# Altium schematic sheet TI_SN74LVCH16T245.SchDoc
size A4; CompanyName: Technische Hochschule Nürnberg Georg Simon Ohm; Address1: Fürther Straße 250; Address2: 90429 Nürnberg; Address3: GERMANY; SheetNumber: 17; SheetTotal: 17; CompanyName2: Institut ELSYS
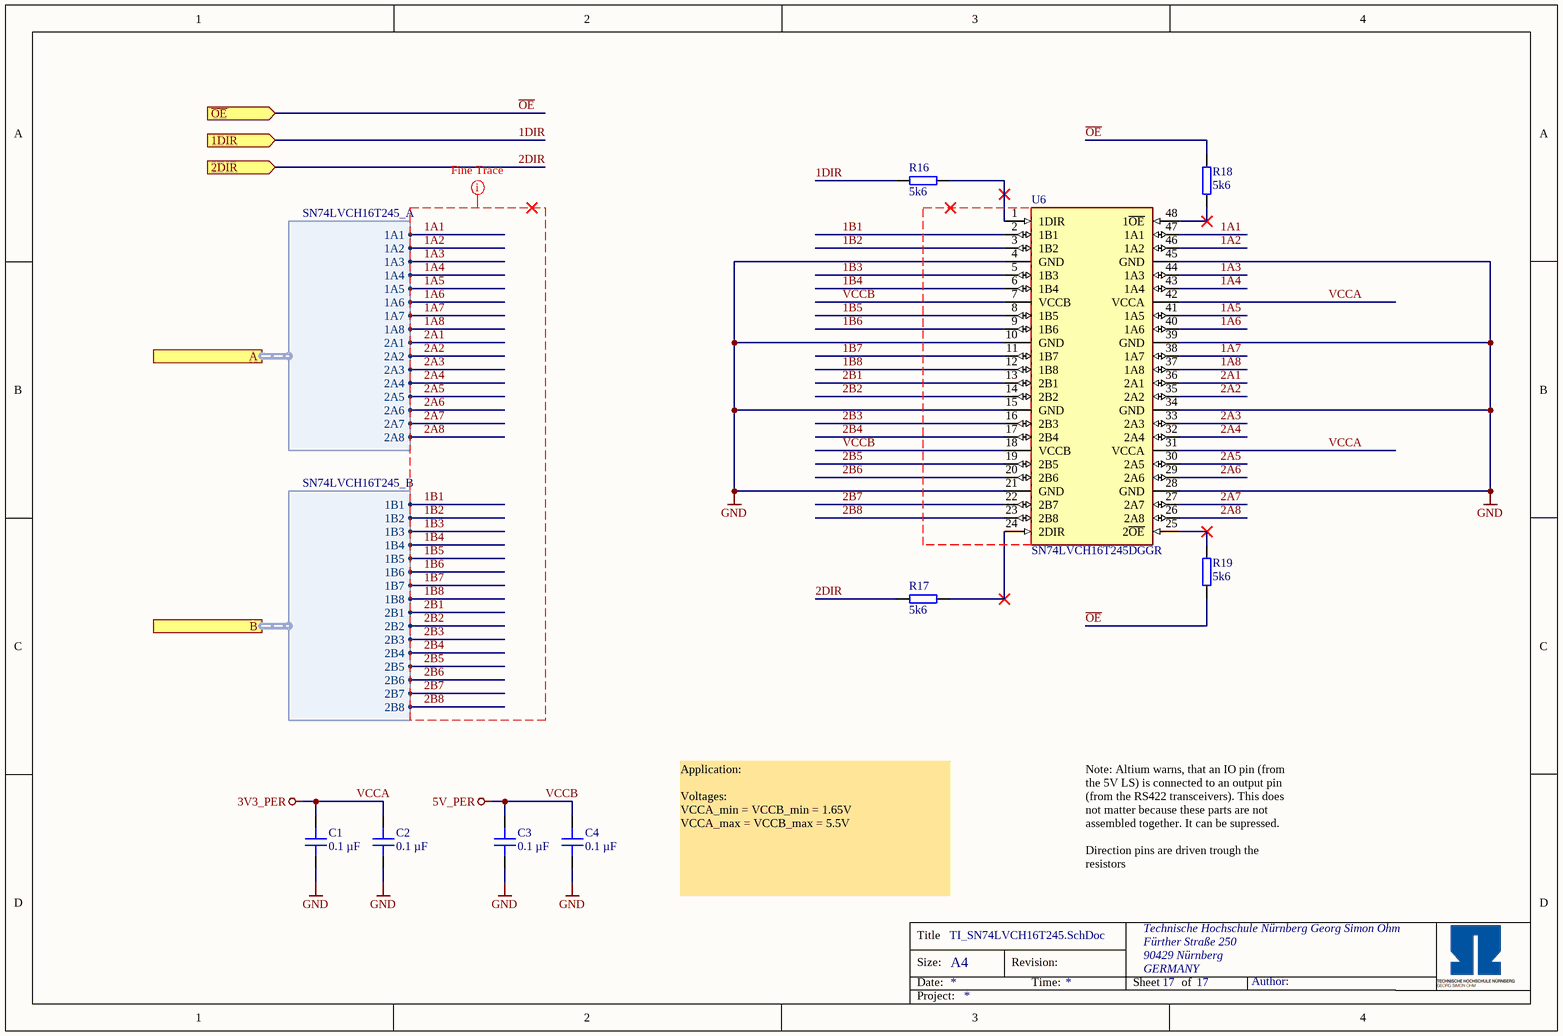
[diagram p0: TI_SN74LVCH16T245.SchDoc]

## Parts
C1  0.1 µF  [C_0603]
C2  0.1 µF  [C_0603]
C3  0.1 µF  [C_0603]
C4  0.1 µF  [C_0603]
R16  5k6  [RES 0603_1608]
R17  5k6  [RES 0603_1608]
R18  5k6  [RES 0603_1608]
R19  5k6  [RES 0603_1608]
U6  SN74LVCH16T245DGGR  [TI_DGG-R-PDSO-G48N]

## Ports
1DIR (in), 2DIR (in), A (harness SN74LVCH16T245_A), B (harness SN74LVCH16T245_B), ~{OE} (in)

## Harnesses
SN74LVCH16T245_A: 1A1, 1A2, 1A3, 1A4, 1A5, 1A6, 1A7, 1A8, 2A1, 2A2, 2A3, 2A4, 2A5, 2A6, 2A7, 2A8
SN74LVCH16T245_B: 1B1, 1B2, 1B3, 1B4, 1B5, 1B6, 1B7, 1B8, 2B1, 2B2, 2B3, 2B4, 2B5, 2B6, 2B7, 2B8

## Nets
GND: C1.1 C2.1 C3.1 C4.1 U6.4(GND) U6.10(GND) U6.15(GND) U6.21(GND) U6.28(GND) U6.34(GND) U6.39(GND) U6.45(GND)
VCCA: C1.2 C2.2 U6.31(VCCA) U6.42(VCCA)  [also labelled 3V3_PER]
VCCB: C3.2 C4.2 U6.7(VCCB) U6.18(VCCB)  [also labelled 5V_PER]
1A1: U6.47(1A1) ; port A.1A1
1A2: U6.46(1A2) ; port A.1A2
1A3: U6.44(1A3) ; port A.1A3
1A4: U6.43(1A4) ; port A.1A4
1A5: U6.41(1A5) ; port A.1A5
1A6: U6.40(1A6) ; port A.1A6
1A7: U6.38(1A7) ; port A.1A7
1A8: U6.37(1A8) ; port A.1A8
1B1: U6.2(1B1) ; port B.1B1
1B2: U6.3(1B2) ; port B.1B2
1B3: U6.5(1B3) ; port B.1B3
1B4: U6.6(1B4) ; port B.1B4
1B5: U6.8(1B5) ; port B.1B5
1B6: U6.9(1B6) ; port B.1B6
1B7: U6.11(1B7) ; port B.1B7
1B8: U6.12(1B8) ; port B.1B8
1DIR: R16.2 ; port 1DIR
2A1: U6.36(2A1) ; port A.2A1
2A2: U6.35(2A2) ; port A.2A2
2A3: U6.33(2A3) ; port A.2A3
2A4: U6.32(2A4) ; port A.2A4
2A5: U6.30(2A5) ; port A.2A5
2A6: U6.29(2A6) ; port A.2A6
2A7: U6.27(2A7) ; port A.2A7
2A8: U6.26(2A8) ; port A.2A8
2B1: U6.13(2B1) ; port B.2B1
2B2: U6.14(2B2) ; port B.2B2
2B3: U6.16(2B3) ; port B.2B3
2B4: U6.17(2B4) ; port B.2B4
2B5: U6.19(2B5) ; port B.2B5
2B6: U6.20(2B6) ; port B.2B6
2B7: U6.22(2B7) ; port B.2B7
2B8: U6.23(2B8) ; port B.2B8
2DIR: R17.1 ; port 2DIR
~{OE}: R18.2 R19.1 ; port ~{OE}
NetR16_1: R16.1 U6.1(1DIR)
NetR17_2: R17.2 U6.24(2DIR)
NetR18_1: R18.1 U6.48(1~{OE})
NetR19_2: R19.2 U6.25(2~{OE})

## Layout directives
net class Fine Trace: 1A1, 1A2, 1A3, 1A4, 1A5, 1A6, 1A7, 1A8, 1B1, 1B2, 1B3, 1B4, 1B5, 1B6, 1B7, 1B8, 2A1, 2A2, 2A3, 2A4, 2A5, 2A6, 2A7, 2A8, 2B1, 2B2, 2B3, 2B4, 2B5, 2B6, 2B7, 2B8

## Notes on the sheet
- Application:
  Voltages:
  VCCA_min = VCCB_min = 1.65V
  VCCA_max = VCCB_max = 5.5V
- Note: Altium warns, that an IO pin (from the 5V LS) is connected to an output pin (from the RS422 transceivers). This does not matter because these parts are not assembled together. It can be supressed.
  Direction pins are driven trough the resistors
- Title
- Size:
- Date:
- A4
- Revision:
- Time:
- Sheet
- of
- Author:
- Project:

## Library data of the parts
C1-C4 = C0603X104K5RAC7411: Capacitor 0603, 50 VDC, 0.1 µF, X7R; Manufacturer: KEMET; Tolerance: 10 %; Voltage Rating: 50 VDC; Created from: MGremer; Manufacturer Part Number: C0603X104K5RAC7411; PartID: 3; Created On: 20.12.2020 13:54:13; ComponentLink1Description: Datasheet; ComponentLink1URL: https://www.mouser.de/datasheet/2/212/1/KEM_C1013_X7R_FT_CAP_SMD-1103280.pdf; Component Type: Capacitor 0603; Device Package: 0603; Last Updated: 04.03.2021 09:24:28; Mounting Type: SMD; Operating Temperature: -55 - 125°C; Series: SMD Comm X7R Flex; Supplier 1: Mouser; Supplier Part Number 1: 80-C0603X104K5R7411; Type: Capacitor; Value: 0.1 µF; Live Cycle Status: 1; Stock number: Labor SMD Container; LCSC Part Number: C14663; Supplier 2: LCSC; Supplier Part Number 2: C14663
R16-R19 = RK73B1JTTDD562J: SMD resistor E24 series; Manufacturer: KOA Speer; Tolerance: 5%; Created from: MGremer; Manufacturer Part Number: RK73B1JTTDD562J; PartID: 92; Created On: 14.12.2020 16:17:14; ComponentLink1Description: Datasheet; ComponentLink1URL: https://www.mouser.de/datasheet/2/219/RK73B-1825463.pdf; Component Type: SMD resistor; Device Package: 0603; Last Updated: 04.03.2021 09:09:42; Mounting Type: SMD; Supplier 1: Mouser; Supplier Part Number 1: 660-RK73B1JTTDD562J; Type: Resistor; Value: 5k6; Live Cycle Status: 1; Stock number: Labor SMD Container; LCSC Part Number: C23189; Supplier 2: LCSC; Supplier Part Number 2: C23189
U6 = SN74LVCH16T245DGGR: 16-Bit Dual supply Bus Transceiver with configurable Level Shifter and Tri State Output; Manufacturer: Texas Instruments; Value: 1.65 - 5.5 V; Created from: T. Wendt; Manufacturer Part Number: SN74LVCH16T245DGGR; PartID: 4; Created On: 01.03.2021 11:28:41; ComponentLink1Description: Datasheet; ComponentLink1URL: https://www.ti.com/lit/ds/symlink/sn74lvch16t245.pdf?HQS=dis-mous-null-mousermode-dsf-pf-null-wwe&ts=1610963085859&ref_url=https%253A%252F%252Fwww.mouser.it%252F; Component Type: Level Shifter; Device Package: TSSOP-48; Last Updated: 04.03.2021 09:07:38; Mounting Type: SMD; Operating Temperature: -40 - 85 °C; Supplier 1: Mouser; Supplier Part Number 1: 595-SN74LVCH16T245GR; Type: Standard; Live Cycle Status: 1; Stock number: not stored; LCSC Part Number: C352975; Supplier 2: LCSC; Supplier Part Number 2: C352975